# Altium schematic sheet Microcontroller.SchDoc
size A
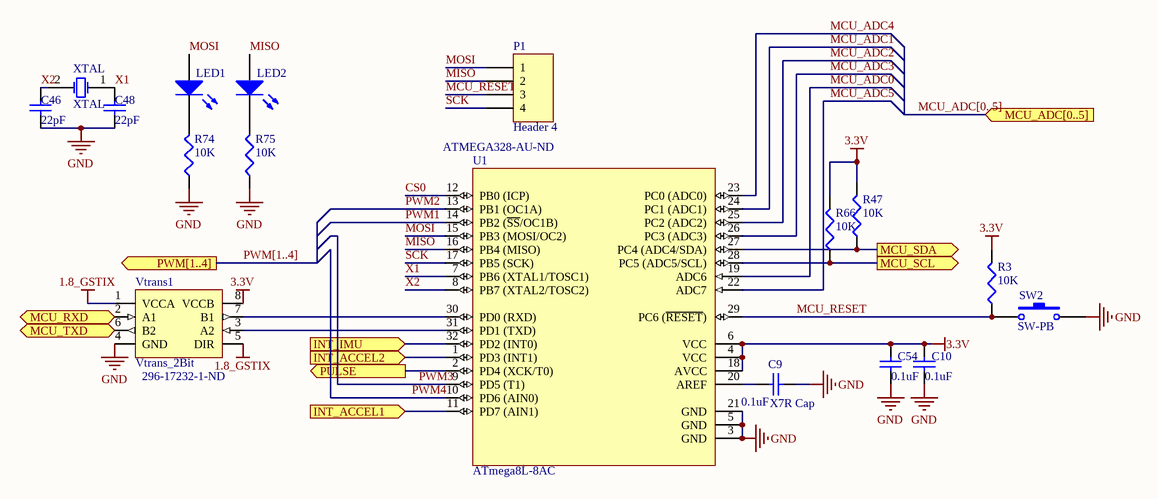
[diagram p0: Microcontroller.SchDoc]

## Parts
C9  X7R Cap  value 0.1uF  [0603_CAP]
C10  value 0.1uF  [0603_CAP]  (hidden comment: X7R Cap)
C46  value 22pF  [0603_CAP]  (hidden comment: X7R Cap)
C48  value 22pF  [0603_CAP]  (hidden comment: X7R Cap)
C54  value 0.1uF  [0603_CAP]  (hidden comment: X7R Cap)
LED1  LED0  [0603_RES]  (value not drawn)
LED2  LED0  [0603_RES]  (value not drawn)
P1  Header 4  [PRG_HEADER]
R3  value 10K  [0603_RES]  (hidden comment: Rpull)
R47  value 10K  [0603_RES]  (hidden comment: Rpull)
R66  value 10K  [0603_RES]  (hidden comment: Rpull)
R74  value 10K  [0603_RES]  (hidden comment: Rpull)
R75  value 10K  [0603_RES]  (hidden comment: Rpull)
SW2  SW-PB  [SM_SW]
U1  ATmega8L-8AC  Supplier Part Number 1: ATMEGA328-AU-ND  [32A_N]
Vtrans1  Vtrans_2Bit  [TSOP65P400X130-8N]
XTAL  XTAL  [XTAL 16Mhz]

## Ports
INT_ACCEL1 (in), INT_ACCEL2 (in), INT_IMU (in), MCU_ADC[0..5] (in), MCU_RXD (in), MCU_SCL (out), MCU_SDA (out), MCU_TXD (out), PULSE (out), PWM[1..4] (out)

## Nets
1.8_GSTIX: Vtrans1.1(VCCA) Vtrans1.5(DIR)
3.3V: C10.1 C54.1 R3.2 R47.2 R66.2 U1.4(VCC) U1.6(VCC) U1.18(AVCC) Vtrans1.8(VCCB)
GND: C9.1 C10.2 C46.2 C48.2 C54.2 R74.1 R75.1 SW2.2 U1.3(GND) U1.5(GND) U1.21(GND) Vtrans1.4(GND)
CS0: U1.12(PB0_(ICP))
INT_ACCEL1: U1.11(PD7_(AIN1)) ; port INT_ACCEL1
INT_ACCEL2: U1.1(PD3_(INT1)) ; port INT_ACCEL2
INT_IMU: U1.32(PD2_(INT0)) ; port INT_IMU
MCU_ADC0: U1.19(ADC6)
MCU_ADC1: U1.24(PC1_(ADC1))
MCU_ADC2: U1.25(PC2_(ADC2))
MCU_ADC3: U1.26(PC3_(ADC3))
MCU_ADC4: U1.23(PC0_(ADC0))
MCU_ADC5: U1.22(ADC7)
MCU_RESET: P1.3 R3.1 SW2.1 U1.29(PC6_(~{RESET}))
MCU_RXD: Vtrans1.2(A1) ; port MCU_RXD
MCU_SCL: R66.1 U1.28(PC5_(ADC5/SCL)) ; port MCU_SCL
MCU_SDA: R47.1 U1.27(PC4_(ADC4/SDA)) ; port MCU_SDA
MCU_TXD: Vtrans1.6(B2) ; port MCU_TXD
MISO: LED2.1(A) P1.2 U1.16(PB4_(MISO))
MOSI: LED1.1(A) P1.1 U1.15(PB3_(MOSI/OC2))
PULSE: U1.2(PD4_(XCK/T0)) ; port PULSE
PWM1: U1.14(PB2_(~{SS}/OC1B))
PWM2: U1.13(PB1_(OC1A))
PWM3: U1.9(PD5_(T1))
PWM4: U1.10(PD6_(AIN0))
SCK: P1.4 U1.17(PB5_(SCK))
X1: C48.1 U1.7(PB6_(XTAL1/TOSC1)) XTAL.1(OSC1)
X2: C46.1 U1.8(PB7_(XTAL2/TOSC2)) XTAL.2(OSC2)
NetC9_2: C9.2 U1.20(AREF)
NetLED1_2: LED1.2(K) R74.2
NetLED2_2: LED2.2(K) R75.2
NetU1_30: U1.30(PD0_(RXD)) Vtrans1.7(B1)
NetU1_31: U1.31(PD1_(TXD)) Vtrans1.3(A2)

## Buses and harness runs
bus MCU_ADC[0..5] = port MCU_ADC[0..5]
bus PWM[1..4] = port PWM[1..4]

## Library data of the parts
C9 C10 C46 C48 C54 = Cap: Capacitor; Published: 8-Jun-2000; LatestRevisionDate: 17-Jul-2002; LatestRevisionNote: Re-released for DXP Platform.; PackageReference: RAD-0.3; Publisher: Altium Limited
LED1 LED2 = LED0: Typical INFRARED GaAs LED; Published: 8-Jun-2000; LatestRevisionDate: 08-Jul-2005; LatestRevisionNote: Mech Layer 1 removed.; PackageReference: LED-0; Publisher: Altium Limited
P1 = Header 4: Header, 4-Pin; LatestRevisionDate: 17-Jul-2002; LatestRevisionNote: Re-released for DXP Platform.; Publisher: Altium Limited
R3 R47 R66 R74 R75 = Rpull: Resistor; Published: 8-Jun-2000; LatestRevisionDate: 29-May-2009; LatestRevisionNote: IPC-7351 Footprint Added.; PackageReference: J1-0603; Publisher: Altium Limited; PackageDescription: Chip Resistor
SW2 = SW-PB: Switch; Manufacturer: C&K Components; Manufacturer Part Number: PTS525SK08SMTR LFS; Description: SWITCH TACTILE SPST-NO 0.05A 12V; Circuit: SPST-NO; Switch Function: Off-Mom; Contact Rating @ Voltage: 0.05A @ 12VDC; Actuator Type: Standard; Outline: 5.25mm x 5.25mm; Illumination: Non-Illuminated; Operating Force: 260gf; Published: 24-Mar-1999; LatestRevisionDate: 17-Jul-2002; LatestRevisionNote: Re-released for DXP Platform.; PackageReference: SPST-2; Publisher: Altium Limited; RoHS: RoHS Compliant; Category: Switches; Mounting Type: Surface Mount; Termination Style: Gull Wing; Orientation: Vertical; ComponentLink1URL: http://www.ck-components.com/index.php?module=media&action=Display&cmpref=14407&lang=en&width=&height=&format=&alt=; ComponentLink1Description: http://www.ck-components.com/index.php?module=media&action=Display&cmpref=14407&lang=en&width=&height=&format=&alt=; Supplier 1: Sparkfun; Supplier Part Number 1: COM-08229
U1 = ATmega8L-8AC: 8-Bit AVR Microcontroller with 8K Bytes of In-System Programmable Flash Memory; Manufacturer: Atmel; Manufacturer Part Number: ATMEGA328-AU; Description: IC MCU AVR 32K FLASH 32TQFP; Speed: 20MHz; Connectivity: I²C, SPI, UART/USART; Peripherals: Brown-out Detect/Reset, POR, PWM, WDT; Number of I /O: 23; Program Memory Size: 32KB (16K x 16); EEPROM Size: 1K x 8; RAM Size: 2K x 8; Voltage - Supply (Vcc/Vdd): 1.8 V ~ 5.5 V; Data Converters: A/D 8x10b; Oscillator Type: Internal; Published: 17-Sep-2003; LatestRevisionDate: 13-Apr-2006; LatestRevisionNote: IPC-7351 Footprint Added.; DatasheetVersion: 2486H-AVR-09/02; PackageVersion: revB, Oct-2001; PackageReference: 32A; Publisher: Altium Limited; PackageDescription: 32-Pin Thin Quad Flat Pack 0.8 mm Pitch; Code_JEDEC: MS-026-ABA; ComponentLink1Description: Manufacturer Link; ComponentLink1URL: http://www.atmel.com; ComponentLink2Description: Datasheet; ComponentLink2URL: http://www.atmel.com/dyn/resources/prod_documents/doc2486.pdf; Supplier 1: Digi-Key; RoHS: RoHS Compliant; Category: Integrated Circuits (ICs); Stock 1: 2099; Pricing 1: 1=3.83, 25=2.4032, 100=2.136 (USD); Core Processor: AVR; Core Size: 8-Bit; Program Memory Type: FLASH; Operating Temperature: -40°C ~ 85°C; Package / Case: 32-TQFP; Packaging: Tray; ComponentLink3URL: http://www.atmel.com/dyn/resources/prod_documents/8271S.pdf; ComponentLink3Description: http://www.atmel.com/dyn/resources/prod_documents/8271S.pdf
Vtrans1 = Vtrans_2Bit: 296-17232-1-ND; Manufacturer: Texas Instruments; Manufacturer Part Number: SN74AVC2T45DCTR; Description: IC BUS TXRX TRI-ST 2BIT SM8; Logic Function: Translator, Bidirectional, 3-State; Number of Bits: 2; Input Type: Logic; Data Rate: 500Mbps; Number of Outputs/Channel: 1; Differential - Input:Output: No/No; Propagation Delay (Max): 2.4ns; Voltage - Supply: 1.2 V ~ 3.6 V; Supplier 1: Digi-Key; Supplier Part Number 1: 296-17232-1-ND; RoHS: RoHS Compliant; Category: Integrated Circuits (ICs); Stock 1: 20310; Pricing 1: 1=0.84, 25=0.646, 100=0.57, 250=0.494, 500=0.418, 1000=0.3325 (USD); Output Type: Logic; Number of Channels: 2; Operating Temperature: -40°C ~ 85°C; Package / Case: 8-LSSOP (0.11", 2.80mm Width); Supplier Device Package: SM8; Packaging: Cut Tape (CT); ComponentLink1URL: http://www.ti.com/lit/ds/symlink/sn74avc2t45.pdf; ComponentLink1Description: http://www.ti.com/lit/ds/symlink/sn74avc2t45.pdf
XTAL = XTAL: Crystal Oscillator; Published: 8-Jun-2000; LatestRevisionDate: 17-Jul-2002; LatestRevisionNote: Re-released for DXP Platform.; PackageReference: R38; Publisher: Altium Limited; Supplier 1: Farnell; Supplier Part Number 1: 1640930